# Altium schematic sheet 4_cpu.SchDoc: CPU (STM32F427VIT6)
size A3; SheetNumber: 4; SheetTotal: 8
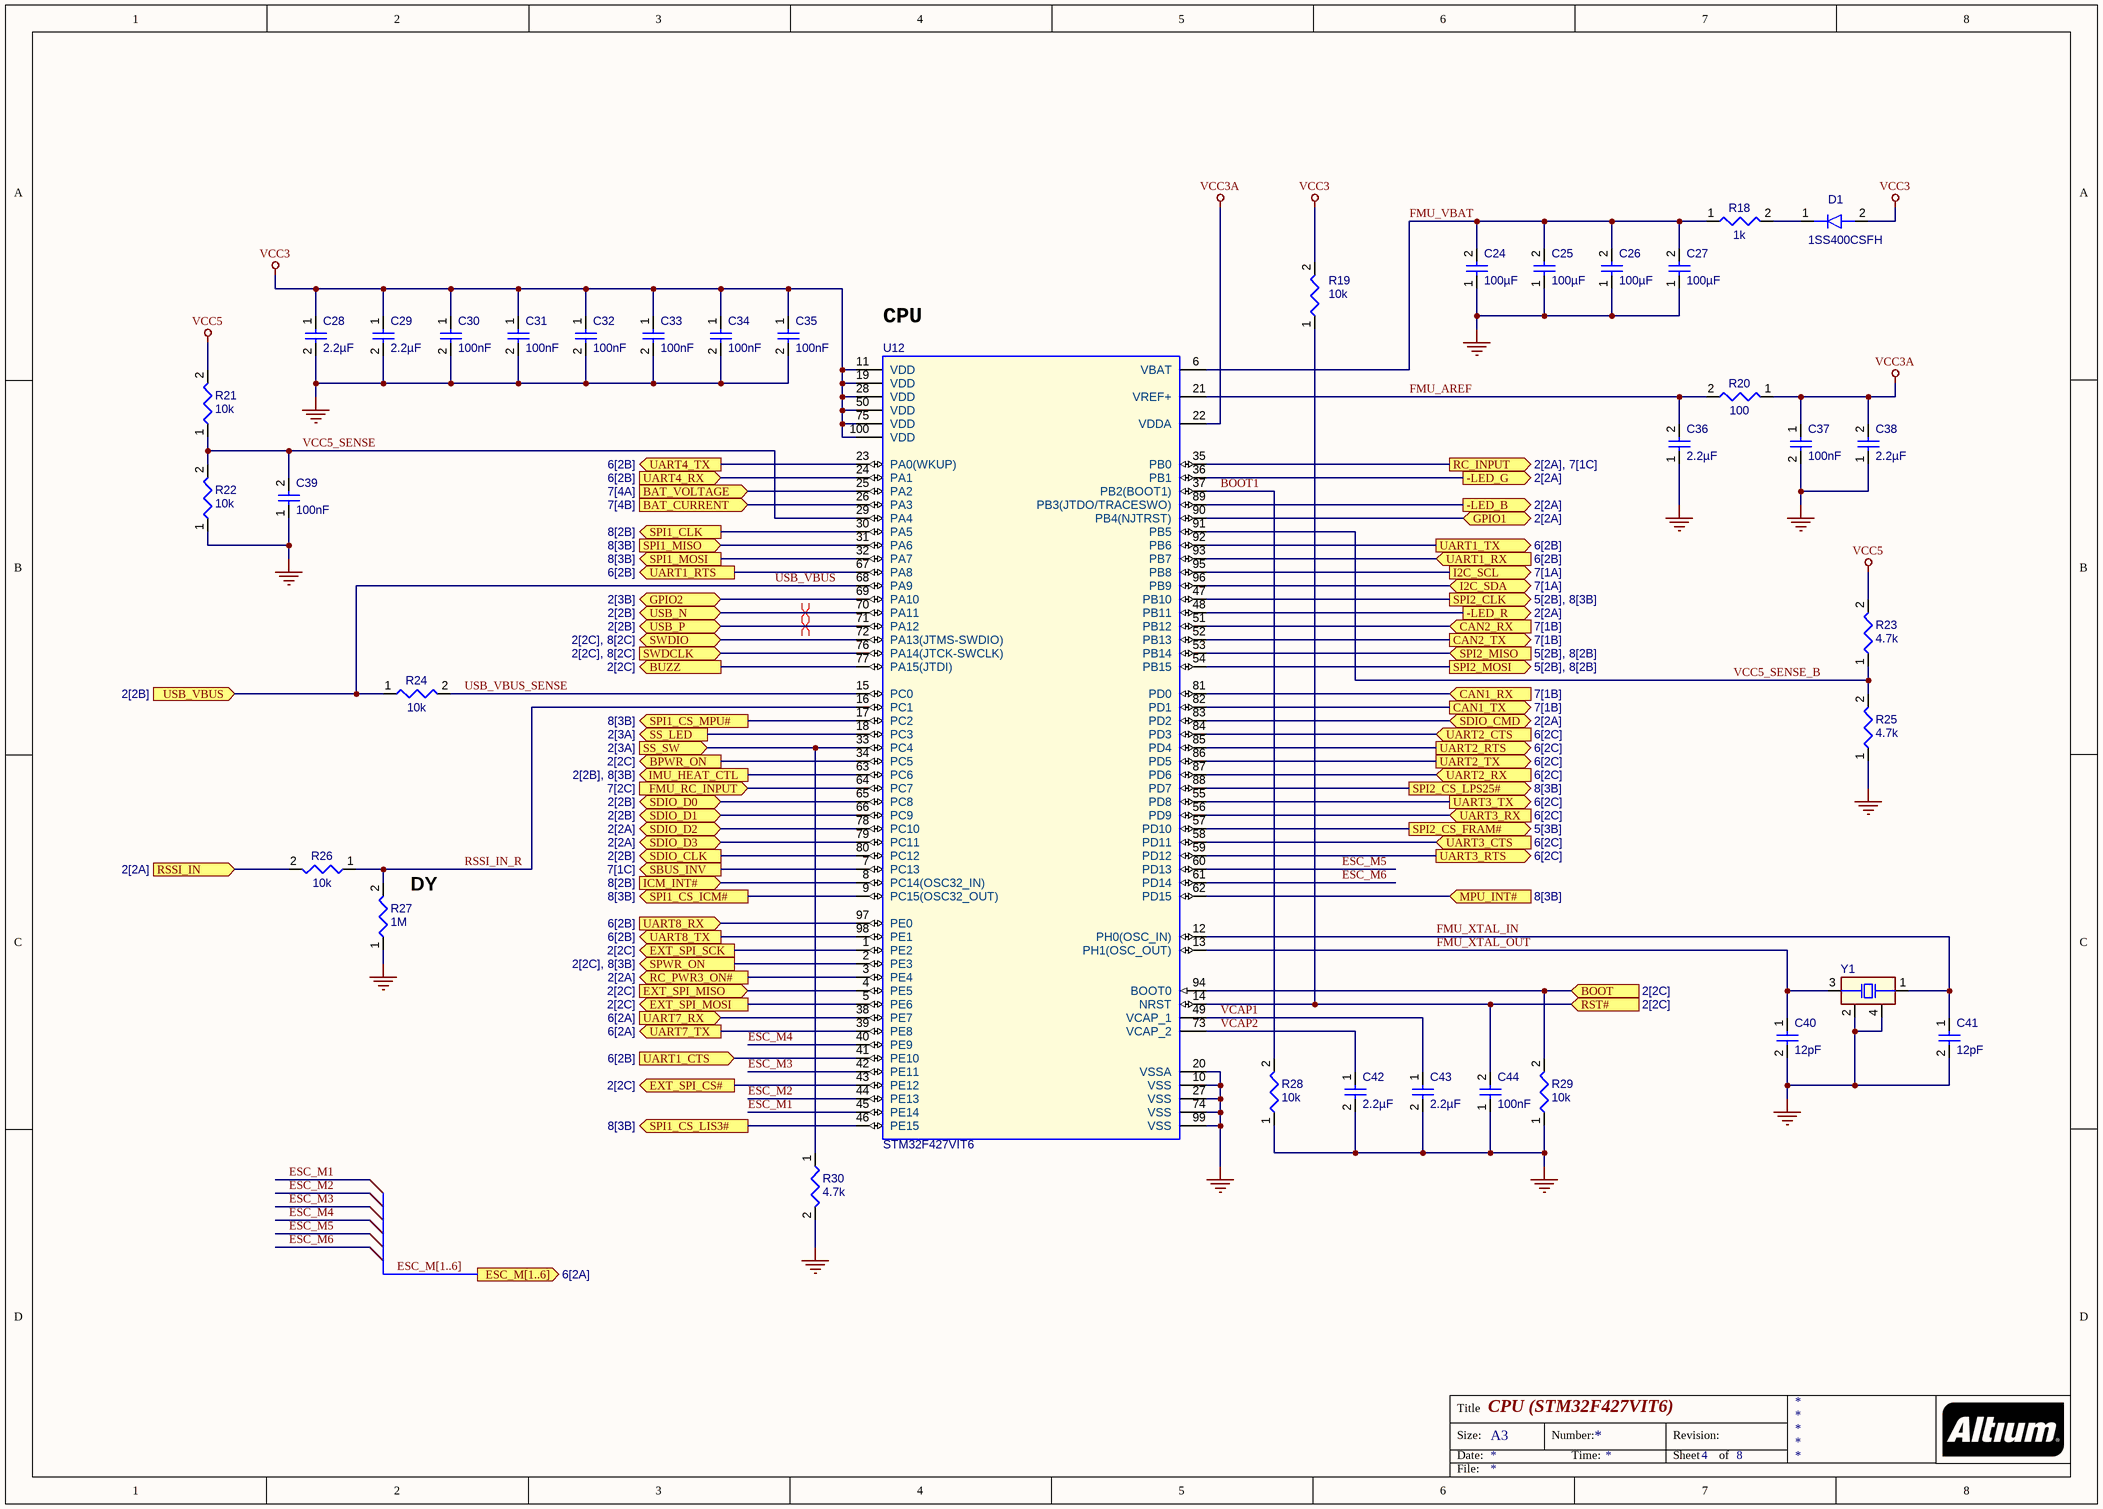
[diagram p0: 4_cpu.SchDoc]

## Parts
C24  value 100µF  [CAPC0805(2012)145_L]  (hidden comment: Capacitor 100µF +/-20% 6.3V 0805)
C25  value 100µF  [CAPC0805(2012)145_L]  (hidden comment: Capacitor 100µF +/-20% 6.3V 0805)
C26  value 100µF  [CAPC0805(2012)145_L]  (hidden comment: Capacitor 100µF +/-20% 6.3V 0805)
C27  value 100µF  [CAPC0805(2012)145_L]  (hidden comment: Capacitor 100µF +/-20% 6.3V 0805)
C28  value 2.2µF  [CAPC0402(1005)60_L]  (hidden comment: Capacitor 2,2µF +/-20% 10V 0402)
C29  value 2.2µF  [CAPC0402(1005)60_L]  (hidden comment: Capacitor 2,2µF +/-20% 10V 0402)
C30  value 100nF  [CAPC0402(1005)60_L]  (hidden comment: Capacitor 100nF +/-20% 10V 0402)
C31  value 100nF  [CAPC0402(1005)60_L]  (hidden comment: Capacitor 100nF +/-20% 10V 0402)
C32  value 100nF  [CAPC0402(1005)60_L]  (hidden comment: Capacitor 100nF +/-20% 10V 0402)
C33  value 100nF  [CAPC0402(1005)60_L]  (hidden comment: Capacitor 100nF +/-20% 10V 0402)
C34  value 100nF  [CAPC0402(1005)60_L]  (hidden comment: Capacitor 100nF +/-20% 10V 0402)
C35  value 100nF  [CAPC0402(1005)60_L]  (hidden comment: Capacitor 100nF +/-20% 10V 0402)
C36  value 2.2µF  [CAPC0402(1005)60_L]  (hidden comment: Capacitor 2,2µF +/-20% 10V 0402)
C37  value 100nF  [CAPC0402(1005)60_L]  (hidden comment: Capacitor 100nF +/-20% 10V 0402)
C38  value 2.2µF  [CAPC0402(1005)60_L]  (hidden comment: Capacitor 2,2µF +/-20% 10V 0402)
C39  value 100nF  [CAPC0402(1005)60_L]  (hidden comment: Capacitor 100nF +/-20% 10V 0402)
C40  value 12pF  [CAPC0402(1005)33_L]  (hidden comment: Capacitor 12pF +/-10% 50V 0402)
C41  value 12pF  [CAPC0402(1005)33_L]  (hidden comment: Capacitor 12pF +/-10% 50V 0402)
C42  value 2.2µF  [CAPC0402(1005)60_L]  (hidden comment: Capacitor 2,2µF +/-20% 10V 0402)
C43  value 2.2µF  [CAPC0402(1005)60_L]  (hidden comment: Capacitor 2,2µF +/-20% 10V 0402)
C44  value 100nF  [CAPC0402(1005)60_L]  (hidden comment: Capacitor 100nF +/-20% 10V 0402)
D1  1SS400CSFH  [ROHM-VMN2-2_V]
R18  value 1k  [RESC0402(1005)_L]  (hidden comment: Resistor 1K +/-5 % 0402 63 mW)
R19  value 10k  [RESC0402(1005)_L]  (hidden comment: Resistor 10K  +/-1 % 0402 63 mW)
R20  value 100  [RESC0402(1005)_L]  (hidden comment: Resistor 100R +/-1 % 0402 63 mW)
R21  value 10k  [RESC0402(1005)_L]  (hidden comment: Resistor 10K  +/-1 % 0402 63 mW)
R22  value 10k  [RESC0402(1005)_L]  (hidden comment: Resistor 10K  +/-1 % 0402 63 mW)
R23  value 4.7k  [RESC0402(1005)_L]  (hidden comment: Resistor 4K7  +/-1 % 0402 63 mW)
R24  value 10k  [RESC0402(1005)_L]  (hidden comment: Resistor 10K  +/-1 % 0402 63 mW)
R25  value 4.7k  [RESC0402(1005)_L]  (hidden comment: Resistor 4K7  +/-1 % 0402 63 mW)
R26  value 10k  [RESC0402(1005)_L]  (hidden comment: Resistor 10K  +/-1 % 0402 63 mW)
R27  value 1M  [RESC0402(1005)_L]  (hidden comment: Resistor 1M +/-5 % 0402 63 mW)
R28  value 10k  [RESC0402(1005)_L]  (hidden comment: Resistor 10K  +/-1 % 0402 63 mW)
R29  value 10k  [RESC0402(1005)_L]  (hidden comment: Resistor 10K  +/-1 % 0402 63 mW)
R30  value 4.7k  [RESC0402(1005)_L]  (hidden comment: Resistor 4K7  +/-1 % 0402 63 mW)
U12  STM32F427VIT6  [STM-LQFP100]
Y1  FA-12824.0000MF10Z-W3  [EPSON-FA-128_V]  (value not drawn)

## Ports
-LED_B (out, see 2[2A]), -LED_G (out, see 2[2A]), -LED_R (out, see 2[2A]), BAT_CURRENT (in, see 7[4B]), BAT_VOLTAGE (in, see 7[4A]), BOOT (in, see 2[2C]), BPWR_ON (out, see 2[2C]), BUZZ (out, see 2[2C]), CAN1_RX (in, see 7[1B]), CAN1_TX (out, see 7[1B]), CAN2_RX (in, see 7[1B]), CAN2_TX (out, see 7[1B]), ESC_M[1..6] (out, see 6[2A]), EXT_SPI_CS# (out, see 2[2C]), EXT_SPI_MISO (in, see 2[2C]), EXT_SPI_MOSI (out, see 2[2C]), EXT_SPI_SCK (out, see 2[2C]), FMU_RC_INPUT (in, see 7[2C]), GPIO1 (bidir, see 2[2A]), GPIO2 (bidir, see 2[3B]), I2C_SCL (out, see 7[1A]), I2C_SDA (bidir, see 7[1A]), ICM_INT# (in, see 8[2B]), IMU_HEAT_CTL (out, see 2[2B], 8[3B]), MPU_INT# (in, see 8[3B]), RC_INPUT (out, see 2[2A], 7[1C]), RC_PWR3_ON# (out, see 2[2A]), RSSI_IN (in, see 2[2A]), RST# (in, see 2[2C]), SBUS_INV (out, see 7[1C]), SDIO_CLK (out, see 2[2B]), SDIO_CMD (bidir, see 2[2A]), SDIO_D0 (bidir, see 2[2B]), SDIO_D1 (bidir, see 2[2B]), SDIO_D2 (bidir, see 2[2A]), SDIO_D3 (bidir, see 2[2A]), SPI1_CLK (out, see 8[2B]), SPI1_CS_ICM# (out, see 8[3B]), SPI1_CS_LIS3# (out, see 8[3B]), SPI1_CS_MPU# (out, see 8[3B]), SPI1_MISO (in, see 8[3B]), SPI1_MOSI (out, see 8[3B]), SPI2_CLK (out, see 5[2B], 8[3B]), SPI2_CS_FRAM# (out, see 5[3B]), SPI2_CS_LPS25# (out, see 8[3B]), SPI2_MISO (in, see 5[2B], 8[2B]), SPI2_MOSI (out, see 5[2B], 8[2B]), SPWR_ON (out, see 2[2C], 8[3B]), SS_LED (out, see 2[3A]), SS_SW (in, see 2[3A]), SWDCLK (in, see 2[2C], 8[2C]), SWDIO (bidir, see 2[2C], 8[2C]), UART1_CTS (in, see 6[2B]), UART1_RTS (out, see 6[2B]), UART1_RX (in, see 6[2B]), UART1_TX (out, see 6[2B]), UART2_CTS (in, see 6[2C]), UART2_RTS (out, see 6[2C]), UART2_RX (in, see 6[2C]), UART2_TX (out, see 6[2C]), UART3_CTS (in, see 6[2C]), UART3_RTS (out, see 6[2C]), UART3_RX (in, see 6[2C]), UART3_TX (out, see 6[2C]), UART4_RX (in, see 6[2B]), UART4_TX (out, see 6[2B]), UART7_RX (in, see 6[2A]), UART7_TX (out, see 6[2A]), UART8_RX (in, see 6[2B]), UART8_TX (out, see 6[2B]), USB_N (bidir, see 2[2B]), USB_P (bidir, see 2[2B]), USB_VBUS (in, see 2[2B])

## Nets
GND: C24.1 C25.1 C26.1 C27.1 C28.2 C29.2 C30.2 C31.2 C32.2 C33.2 C34.2 C35.2 C36.1 C37.2 C38.1 C39.1 C40.2 C41.2 C42.2 C43.2 C44.1 R22.1 R25.1 R27.1 R28.1 R29.1 R30.2 U12.10(VSS) U12.20(VSSA) U12.27(VSS) U12.74(VSS) U12.99(VSS) Y1.2(NC) Y1.4(NC)
VCC3: C28.1 C29.1 C30.1 C31.1 C32.1 C33.1 C34.1 C35.1 D1.2(A) R19.2 U12.11(VDD) U12.19(VDD) U12.28(VDD) U12.50(VDD) U12.75(VDD) U12.100(VDD)
VCC3A: C37.1 C38.2 R20.1 U12.22(VDDA)
VCC5: R21.2 R23.2
-LED_B: U12.89(PB3(JTDO/TRACESWO)) ; port -LED_B
-LED_G: U12.36(PB1) ; port -LED_G
-LED_R: U12.48(PB11) ; port -LED_R
BAT_CURRENT: U12.26(PA3) ; port BAT_CURRENT
BAT_VOLTAGE: U12.25(PA2) ; port BAT_VOLTAGE
BOOT: R29.2 U12.94(BOOT0) ; port BOOT
BOOT1: R28.2 U12.37(PB2(BOOT1))
BPWR_ON: U12.34(PC5) ; port BPWR_ON
BUZZ: U12.77(PA15(JTDI)) ; port BUZZ
CAN1_RX: U12.81(PD0) ; port CAN1_RX
CAN1_TX: U12.82(PD1) ; port CAN1_TX
CAN2_RX: U12.51(PB12) ; port CAN2_RX
CAN2_TX: U12.52(PB13) ; port CAN2_TX
ESC_M1: U12.45(PE14)
ESC_M2: U12.44(PE13)
ESC_M3: U12.42(PE11)
ESC_M4: U12.40(PE9)
ESC_M5: U12.60(PD13)
ESC_M6: U12.61(PD14)
EXT_SPI_CS#: U12.43(PE12) ; port EXT_SPI_CS#
EXT_SPI_MISO: U12.4(PE5) ; port EXT_SPI_MISO
EXT_SPI_MOSI: U12.5(PE6) ; port EXT_SPI_MOSI
EXT_SPI_SCK: U12.1(PE2) ; port EXT_SPI_SCK
FMU_AREF: C36.2 R20.2 U12.21(VREF+)
FMU_RC_INPUT: U12.64(PC7) ; port FMU_RC_INPUT
FMU_VBAT: C24.2 C25.2 C26.2 C27.2 R18.1 U12.6(VBAT)
FMU_XTAL_IN: C41.1 U12.12(PH0(OSC_IN)) Y1.1(X1)
FMU_XTAL_OUT: C40.1 U12.13(PH1(OSC_OUT)) Y1.3(X2)
GPIO1: U12.90(PB4(NJTRST)) ; port GPIO1
GPIO2: U12.69(PA10) ; port GPIO2
I2C_SCL: U12.95(PB8) ; port I2C_SCL
I2C_SDA: U12.96(PB9) ; port I2C_SDA
ICM_INT#: U12.8(PC14(OSC32_IN)) ; port ICM_INT#
IMU_HEAT_CTL: U12.63(PC6) ; port IMU_HEAT_CTL
MPU_INT#: U12.62(PD15) ; port MPU_INT#
RC_INPUT: U12.35(PB0) ; port RC_INPUT
RC_PWR3_ON#: U12.3(PE4) ; port RC_PWR3_ON#
RSSI_IN: R26.2 ; port RSSI_IN
RSSI_IN_R: R26.1 R27.2 U12.16(PC1)
RST#: C44.2 R19.1 U12.14(NRST) ; port RST#
SBUS_INV: U12.7(PC13) ; port SBUS_INV
SDIO_CLK: U12.80(PC12) ; port SDIO_CLK
SDIO_CMD: U12.83(PD2) ; port SDIO_CMD
SDIO_D0: U12.65(PC8) ; port SDIO_D0
SDIO_D1: U12.66(PC9) ; port SDIO_D1
SDIO_D2: U12.78(PC10) ; port SDIO_D2
SDIO_D3: U12.79(PC11) ; port SDIO_D3
SPI1_CLK: U12.30(PA5) ; port SPI1_CLK
SPI1_CS_ICM#: U12.9(PC15(OSC32_OUT)) ; port SPI1_CS_ICM#
SPI1_CS_LIS3#: U12.46(PE15) ; port SPI1_CS_LIS3#
SPI1_CS_MPU#: U12.17(PC2) ; port SPI1_CS_MPU#
SPI1_MISO: U12.31(PA6) ; port SPI1_MISO
SPI1_MOSI: U12.32(PA7) ; port SPI1_MOSI
SPI2_CLK: U12.47(PB10) ; port SPI2_CLK
SPI2_CS_FRAM#: U12.57(PD10) ; port SPI2_CS_FRAM#
SPI2_CS_LPS25#: U12.88(PD7) ; port SPI2_CS_LPS25#
SPI2_MISO: U12.53(PB14) ; port SPI2_MISO
SPI2_MOSI: U12.54(PB15) ; port SPI2_MOSI
SPWR_ON: U12.2(PE3) ; port SPWR_ON
SS_LED: U12.18(PC3) ; port SS_LED
SS_SW: R30.1 U12.33(PC4) ; port SS_SW
SWDCLK: U12.76(PA14(JTCK-SWCLK)) ; port SWDCLK
SWDIO: U12.72(PA13(JTMS-SWDIO)) ; port SWDIO
UART1_CTS: U12.41(PE10) ; port UART1_CTS
UART1_RTS: U12.67(PA8) ; port UART1_RTS
UART1_RX: U12.93(PB7) ; port UART1_RX
UART1_TX: U12.92(PB6) ; port UART1_TX
UART2_CTS: U12.84(PD3) ; port UART2_CTS
UART2_RTS: U12.85(PD4) ; port UART2_RTS
UART2_RX: U12.87(PD6) ; port UART2_RX
UART2_TX: U12.86(PD5) ; port UART2_TX
UART3_CTS: U12.58(PD11) ; port UART3_CTS
UART3_RTS: U12.59(PD12) ; port UART3_RTS
UART3_RX: U12.56(PD9) ; port UART3_RX
UART3_TX: U12.55(PD8) ; port UART3_TX
UART4_RX: U12.24(PA1) ; port UART4_RX
UART4_TX: U12.23(PA0(WKUP)) ; port UART4_TX
UART7_RX: U12.38(PE7) ; port UART7_RX
UART7_TX: U12.39(PE8) ; port UART7_TX
UART8_RX: U12.97(PE0) ; port UART8_RX
UART8_TX: U12.98(PE1) ; port UART8_TX
USB_N: U12.70(PA11) ; port USB_N
USB_P: U12.71(PA12) ; port USB_P
USB_VBUS: R24.1 U12.68(PA9) ; port USB_VBUS
USB_VBUS_SENSE: R24.2 U12.15(PC0)
VCAP1: C43.1 U12.49(VCAP_1)
VCAP2: C42.1 U12.73(VCAP_2)
VCC5_SENSE: C39.2 R21.1 R22.2 U12.29(PA4)
VCC5_SENSE_B: R23.1 R25.2 U12.91(PB5)
NetD1_1: D1.1(K) R18.2

## Buses and harness runs
bus ESC_M[1..6] = port ESC_M[1..6]

## Layout directives
differential pair; rule Differential Pairs Routing [Pref Gap = 0.15mm    Min Gap  = 0.1mm    Max Gap  = 0.254mmPref Width = 0.15mm    Min Width  = 0.1mm    Max Width  = 0.381mm]: USB_N
differential pair; rule Differential Pairs Routing [Pref Gap = 0.15mm    Min Gap  = 0.1mm    Max Gap  = 0.254mmPref Width = 0.1mm    Min Width  = 0.1mm    Max Width  = 0.381mm]: USB_P

## Notes on the sheet
- (near U12) CPU
- (near R27) DY
- Title
- Size:
- Date:
- A3
- Number:
- Time:
- Revision:
- Sheet
- of
- File:

## Library data of the parts
C24-C27 = Capacitor 100µF +/-20% 6.3V 0805: Chip Capacitor, 100µF +/-20%, 6.3V, 0805, Thickness 1.45 mm; Manufacturer: Murata; Manufacturer Part Number: GRM21BR60G107ME15L; Tolerance: 10%; Max Operating Temperature: 85°C; Mounting Technology: SMT; Case/Package: 0402; Voltage Rating: 6.3V; Min Operating Temperature: -55°C; Pins: 2; Component Type: Capacitors
C28 C29 C36 C38 C42 C43 = Capacitor 2,2µF +/-20% 10V 0402: Chip Capacitor, 2,2µF +/-20%, 10V, 0402, Thickness 0.6 mm; Manufacturer: Murata; Manufacturer Part Number: GRT155R61E225KE13D; Tolerance: 10%; Case/Package: 0603; Voltage Rating: 10V; Pins: 2; Mounting Technology: SMT; Max Operating Temperature: 85°C; Min Operating Temperature: -55°C; Component Type: Capacitors
C30-C35 C37 C39 C44 = Capacitor 100nF +/-20% 10V 0402: Chip Capacitor, 100nF +/-20%, 10V, 0402, Thickness 0.6 mm; Manufacturer: KEMET; Manufacturer Part Number: C0402C104K8RAC; Tolerance: 20%; Case/Package: 0402; Min Operating Temperature: -55°C; Mounting Technology: SMT; Max Operating Temperature: 85°C; Pins: 2; Voltage Rating: 10V; Component Type: Capacitors
C40 C41 = Capacitor 12pF +/-10% 50V 0402: Chip Capacitor, 12pF +/-10%, 50V, 0402, Thickness 0.33 mm; Manufacturer: Murata; Manufacturer Part Number: GCM1555C1H120JA16D; Tolerance: 20%; Case/Package: 0603; Mounting Technology: SMT; Pins: 2; Voltage Rating: 50V; Max Operating Temperature: 85°C; Min Operating Temperature: -55°C; Component Type: Capacitors
D1 = 1SS400CSFH: Switching Diode (High Speed Switching), 80 V, 100 mA, 2-Pin SOD-923, RoHS, Tape and Reel; Manufacturer: Rohm; Manufacturer Part Number: 1SS400CSFHT2RA; Mounting Technology: SMT; Pins: 2; Component Type: Diodes
R18 = Resistor 1K +/-5 % 0402 63 mW: Chip Resistor, 1 kOhms, +/-5 %, 63 mW, -55 to 155 degC, 0402; Manufacturer: Yageo; Manufacturer Part Number: RC0402JR-071KL; Tolerance: 5%; Power: 63mW; Case/Package: 0402; Max Operating Temperature: 155°C; Min Operating Temperature: -55°C; Pins: 2; Component Type: Resistors
R19 R21 R22 R24 R26 R28 R29 = Resistor 10K  +/-1 % 0402 63 mW: Chip Resistor, 10 kOhms, +/-1 %, 63 mW, -55 to 125 degC, 0402; Manufacturer: Vishay Dale; Manufacturer Part Number: CRCW040210K0FKTD; Tolerance: 1%; Power: 63mW; Case/Package: 0402; Max Operating Temperature: 155°C; Min Operating Temperature: -55°C; Pins: 2; Component Type: Resistors
R20 = Resistor 100R +/-1 % 0402 63 mW: Chip Resistor, 100 Ohms, +/-1 %, 63 mW, -55 to 155 degC, 0402; Manufacturer: Vishay Dale; Manufacturer Part Number: CRCW0402100RFKED; Tolerance: 1%; Power: 63mW; Case/Package: 0402; Max Operating Temperature: 155°C; Min Operating Temperature: -55°C; Pins: 2; Component Type: Resistors
R23 R25 R30 = Resistor 4K7  +/-1 % 0402 63 mW: Chip Resistor, 4,7 kOhms, +/-1 %, 63 mW, -55 to 155 degC, 0402; Manufacturer: Panasonic; Manufacturer Part Number: ERJ-2RKF4701X; Tolerance: 1%; Power: 63mW; Case/Package: 0402; Max Operating Temperature: 155°C; Min Operating Temperature: -55°C; Pins: 2; Component Type: Resistors
R27 = Resistor 1M +/-5 % 0402 63 mW: Chip Resistor, 1 MOhms, +/-5 %, 63 mW, -55 to 155 degC, 0402; Manufacturer: Yageo; Manufacturer Part Number: RC0402JR-071ML; Tolerance: 5%; Power: 63mW; Case/Package: 0402; Max Operating Temperature: 155°C; Min Operating Temperature: -55°C; Pins: 2; Component Type: Resistors
U12 = STM32F427VIT6: ARM Cortex-M4 32-bit MCU+FPU, 2048 KB Flash, 256 KB Internal RAM, 82 I/Os, 100-Pin LQFP, -40 to 85 degC, Tape and Reel; Min Supply Voltage: 1.7V; RAM Size: 256; ComponentLink2URL: http://www.st.com/st-web-ui/static/active/en/resource/technical/document/datasheet/DM00071990.pdf; ComponentLink2Description: Datasheet; ComponentLink1Description: Manufacturer URL; Pins: 100; Mounting Technology: Surface Mount; ComponentLink1URL: http://www.st.com/; Component Type: Processors
Y1 = FA-12824.0000MF10Z-W3: Crystal, 24 MHz, +/- 10 ppm, -20 to 75 degC, 4-Pin SMD, RoHS, Tape and Reel; Manufacturer: Epson; ESR: 80; Load Capacitance: 12pF; Frequency: 24MHz; Mounting Technology: SMT; Pins: 4; RoHS Compliant: Yes; Max Operating Temperature: 75°C; Case/Package: SMD/SMT; Min Operating Temperature: -20°C; Manufacturer Part Number: FA-12824.0000MF10Z-W3; Component Type: Crystals & Oscillators